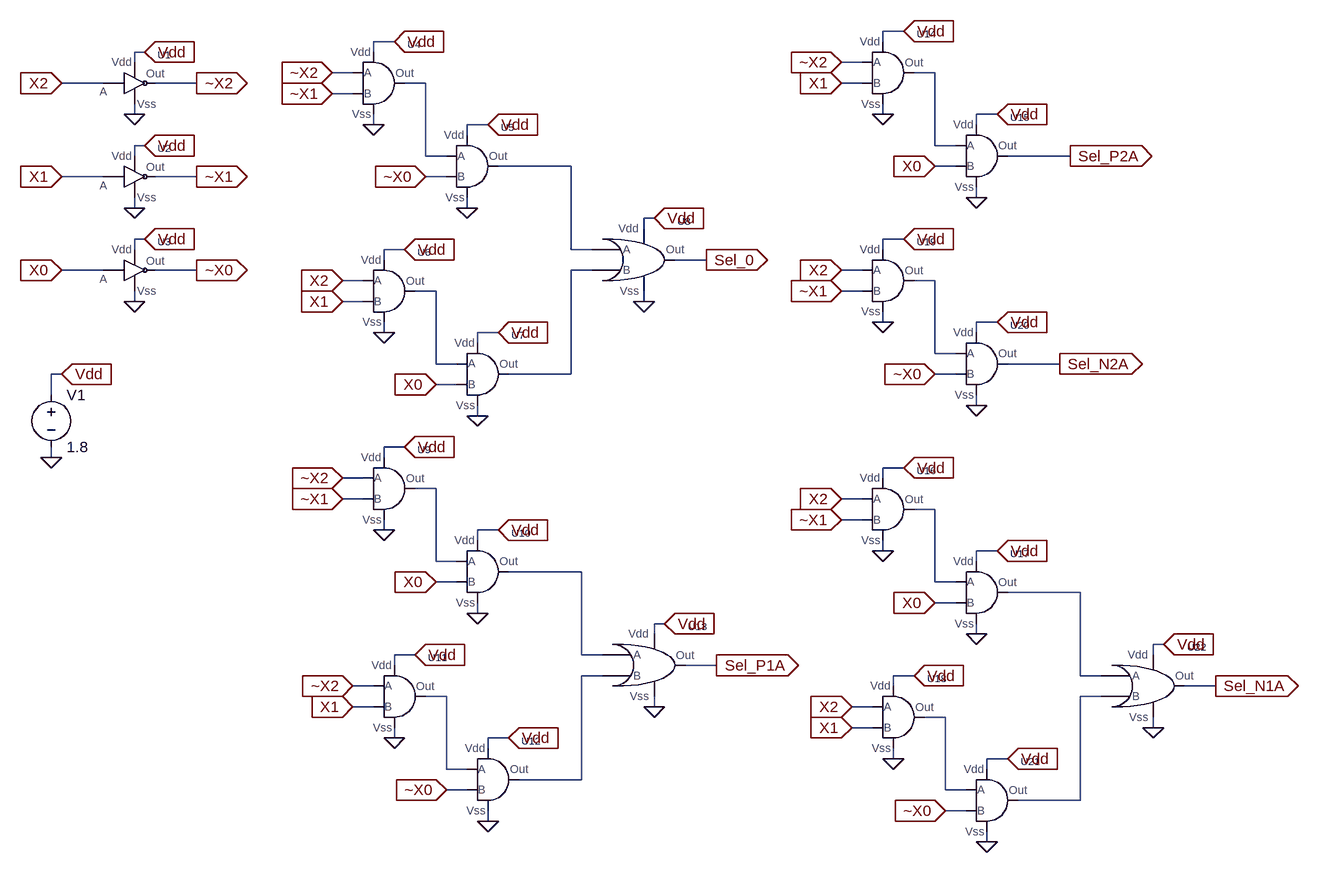
[diagram p0: schematic Encoder.asc]
Encoder.asc, the LTspice schematic file:
Version 4
SHEET 1 2204 1432
WIRE 1360 160 1328 160
WIRE 576 176 544 176
WIRE 1328 176 1328 160
WIRE 192 192 176 192
WIRE 544 192 544 176
WIRE 176 208 176 192
WIRE 1296 208 1264 208
WIRE 512 224 480 224
WIRE 1408 224 1376 224
WIRE 128 240 64 240
WIRE 272 240 208 240
WIRE 624 240 592 240
WIRE 1296 240 1264 240
WIRE 512 256 480 256
WIRE 176 288 176 272
WIRE 1328 288 1328 272
WIRE 1504 288 1472 288
WIRE 544 304 544 288
WIRE 720 304 688 304
WIRE 1472 304 1472 288
WIRE 688 320 688 304
WIRE 192 336 176 336
WIRE 1408 336 1408 224
WIRE 1440 336 1408 336
WIRE 176 352 176 336
WIRE 624 352 624 240
WIRE 656 352 624 352
WIRE 1616 352 1520 352
WIRE 848 368 736 368
WIRE 1440 368 1408 368
WIRE 128 384 64 384
WIRE 272 384 208 384
WIRE 656 384 624 384
WIRE 1472 416 1472 400
WIRE 176 432 176 416
WIRE 688 432 688 416
WIRE 976 448 960 448
WIRE 960 464 960 448
WIRE 192 480 176 480
WIRE 1360 480 1328 480
WIRE 176 496 176 480
WIRE 592 496 560 496
WIRE 848 496 848 368
WIRE 880 496 848 496
WIRE 1328 496 1328 480
WIRE 560 512 560 496
WIRE 1056 512 1008 512
WIRE 128 528 64 528
WIRE 272 528 208 528
WIRE 880 528 848 528
WIRE 1296 528 1264 528
WIRE 528 544 496 544
WIRE 1408 544 1376 544
WIRE 640 560 608 560
WIRE 1296 560 1264 560
WIRE 176 576 176 560
WIRE 528 576 496 576
WIRE 960 576 960 560
WIRE 1328 608 1328 592
WIRE 1504 608 1472 608
WIRE 560 624 560 608
WIRE 736 624 704 624
WIRE 1472 624 1472 608
WIRE 704 640 704 624
WIRE 1408 656 1408 544
WIRE 1440 656 1408 656
WIRE 640 672 640 560
WIRE 672 672 640 672
WIRE 1600 672 1520 672
WIRE 64 688 48 688
WIRE 848 688 848 528
WIRE 848 688 752 688
WIRE 1440 688 1408 688
WIRE 672 704 640 704
WIRE 48 720 48 688
WIRE 1472 736 1472 720
WIRE 704 752 704 736
WIRE 592 800 560 800
WIRE 48 816 48 800
WIRE 560 816 560 800
WIRE 1360 832 1328 832
WIRE 528 848 496 848
WIRE 1328 848 1328 832
WIRE 640 864 608 864
WIRE 528 880 496 880
WIRE 1296 880 1264 880
WIRE 1408 896 1376 896
WIRE 1296 912 1264 912
WIRE 560 928 560 912
WIRE 736 928 704 928
WIRE 704 944 704 928
WIRE 1328 960 1328 944
WIRE 1504 960 1472 960
WIRE 640 976 640 864
WIRE 672 976 640 976
WIRE 1472 976 1472 960
WIRE 864 992 752 992
WIRE 672 1008 640 1008
WIRE 1408 1008 1408 896
WIRE 1440 1008 1408 1008
WIRE 1632 1024 1520 1024
WIRE 1440 1040 1408 1040
WIRE 704 1056 704 1040
WIRE 992 1072 976 1072
WIRE 976 1088 976 1072
WIRE 1472 1088 1472 1072
WIRE 1760 1104 1744 1104
WIRE 608 1120 576 1120
WIRE 864 1120 864 992
WIRE 896 1120 864 1120
WIRE 1744 1120 1744 1104
WIRE 576 1136 576 1120
WIRE 1072 1136 1024 1136
WIRE 896 1152 864 1152
WIRE 1376 1152 1344 1152
WIRE 1632 1152 1632 1024
WIRE 1664 1152 1632 1152
WIRE 544 1168 512 1168
WIRE 1344 1168 1344 1152
WIRE 1840 1168 1792 1168
WIRE 656 1184 624 1184
WIRE 1664 1184 1632 1184
WIRE 544 1200 512 1200
WIRE 976 1200 976 1184
WIRE 1312 1200 1280 1200
WIRE 1424 1216 1392 1216
WIRE 1312 1232 1280 1232
WIRE 1744 1232 1744 1216
WIRE 576 1248 576 1232
WIRE 752 1248 720 1248
WIRE 720 1264 720 1248
WIRE 1344 1280 1344 1264
WIRE 1520 1280 1488 1280
WIRE 656 1296 656 1184
WIRE 688 1296 656 1296
WIRE 1488 1296 1488 1280
WIRE 864 1312 864 1152
WIRE 864 1312 768 1312
WIRE 688 1328 656 1328
WIRE 1424 1328 1424 1216
WIRE 1456 1328 1424 1328
WIRE 1632 1344 1632 1184
WIRE 1632 1344 1536 1344
WIRE 1456 1360 1424 1360
WIRE 720 1376 720 1360
WIRE 1488 1408 1488 1392
FLAG 176 576 0
FLAG 176 432 0
FLAG 176 288 0
FLAG 192 192 Vdd
IOPIN 192 192 In
FLAG 192 336 Vdd
IOPIN 192 336 In
FLAG 192 480 Vdd
IOPIN 192 480 In
FLAG 64 240 X2
IOPIN 64 240 In
FLAG 64 384 X1
IOPIN 64 384 In
FLAG 64 528 X0
IOPIN 64 528 In
FLAG 272 240 ~X2
IOPIN 272 240 Out
FLAG 272 384 ~X1
IOPIN 272 384 Out
FLAG 272 528 ~X0
IOPIN 272 528 Out
FLAG 48 816 0
FLAG 64 688 Vdd
IOPIN 64 688 In
FLAG 480 224 ~X2
IOPIN 480 224 In
FLAG 480 256 ~X1
IOPIN 480 256 In
FLAG 624 384 ~X0
IOPIN 624 384 In
FLAG 576 176 Vdd
IOPIN 576 176 In
FLAG 720 304 Vdd
IOPIN 720 304 In
FLAG 544 304 0
FLAG 688 432 0
FLAG 496 544 X2
IOPIN 496 544 In
FLAG 496 576 X1
IOPIN 496 576 In
FLAG 640 704 X0
IOPIN 640 704 In
FLAG 592 496 Vdd
IOPIN 592 496 In
FLAG 736 624 Vdd
IOPIN 736 624 In
FLAG 560 624 0
FLAG 704 752 0
FLAG 976 448 Vdd
IOPIN 976 448 In
FLAG 960 576 0
FLAG 1056 512 Sel_0
IOPIN 1056 512 Out
FLAG 496 848 ~X2
IOPIN 496 848 In
FLAG 496 880 ~X1
IOPIN 496 880 In
FLAG 640 1008 X0
IOPIN 640 1008 In
FLAG 592 800 Vdd
IOPIN 592 800 In
FLAG 736 928 Vdd
IOPIN 736 928 In
FLAG 560 928 0
FLAG 704 1056 0
FLAG 512 1168 ~X2
IOPIN 512 1168 In
FLAG 512 1200 X1
IOPIN 512 1200 In
FLAG 656 1328 ~X0
IOPIN 656 1328 In
FLAG 608 1120 Vdd
IOPIN 608 1120 In
FLAG 752 1248 Vdd
IOPIN 752 1248 In
FLAG 576 1248 0
FLAG 720 1376 0
FLAG 992 1072 Vdd
IOPIN 992 1072 In
FLAG 976 1200 0
FLAG 1072 1136 Sel_P1A
IOPIN 1072 1136 Out
FLAG 1264 208 ~X2
IOPIN 1264 208 In
FLAG 1264 240 X1
IOPIN 1264 240 In
FLAG 1408 368 X0
IOPIN 1408 368 In
FLAG 1360 160 Vdd
IOPIN 1360 160 In
FLAG 1504 288 Vdd
IOPIN 1504 288 In
FLAG 1328 288 0
FLAG 1472 416 0
FLAG 1616 352 Sel_P2A
IOPIN 1616 352 Out
FLAG 1264 528 X2
IOPIN 1264 528 In
FLAG 1264 560 ~X1
IOPIN 1264 560 In
FLAG 1408 688 ~X0
IOPIN 1408 688 In
FLAG 1360 480 Vdd
IOPIN 1360 480 In
FLAG 1504 608 Vdd
IOPIN 1504 608 In
FLAG 1328 608 0
FLAG 1472 736 0
FLAG 1600 672 Sel_N2A
IOPIN 1600 672 Out
FLAG 1264 880 X2
IOPIN 1264 880 In
FLAG 1264 912 ~X1
IOPIN 1264 912 In
FLAG 1408 1040 X0
IOPIN 1408 1040 In
FLAG 1360 832 Vdd
IOPIN 1360 832 In
FLAG 1504 960 Vdd
IOPIN 1504 960 In
FLAG 1328 960 0
FLAG 1472 1088 0
FLAG 1280 1200 X2
IOPIN 1280 1200 In
FLAG 1280 1232 X1
IOPIN 1280 1232 In
FLAG 1424 1360 ~X0
IOPIN 1424 1360 In
FLAG 1376 1152 Vdd
IOPIN 1376 1152 In
FLAG 1520 1280 Vdd
IOPIN 1520 1280 In
FLAG 1344 1280 0
FLAG 1488 1408 0
FLAG 1760 1104 Vdd
IOPIN 1760 1104 In
FLAG 1744 1232 0
FLAG 1840 1168 Sel_N1A
IOPIN 1840 1168 Out
SYMBOL NOT1 160 240 R0
SYMATTR InstName U1
SYMBOL NOT1 160 384 R0
SYMATTR InstName U2
SYMBOL NOT1 160 528 R0
SYMATTR InstName U3
SYMBOL voltage 48 704 R0
WINDOW 123 0 0 Left 0
WINDOW 39 0 0 Left 0
SYMATTR InstName V1
SYMATTR Value 1.8
SYMBOL AND1 528 240 R0
SYMATTR InstName U4
SYMBOL AND1 672 368 R0
SYMATTR InstName U5
SYMBOL AND1 544 560 R0
SYMATTR InstName U6
SYMBOL AND1 688 688 R0
SYMATTR InstName U7
SYMBOL OR1 896 512 R0
SYMATTR InstName U8
SYMBOL AND1 544 864 R0
SYMATTR InstName U9
SYMBOL AND1 688 992 R0
SYMATTR InstName U10
SYMBOL AND1 560 1184 R0
SYMATTR InstName U11
SYMBOL AND1 704 1312 R0
SYMATTR InstName U12
SYMBOL OR1 912 1136 R0
SYMATTR InstName U13
SYMBOL AND1 1312 224 R0
SYMATTR InstName U14
SYMBOL AND1 1456 352 R0
SYMATTR InstName U15
SYMBOL AND1 1312 544 R0
SYMATTR InstName U19
SYMBOL AND1 1456 672 R0
SYMATTR InstName U20
SYMBOL AND1 1312 896 R0
SYMATTR InstName U16
SYMBOL AND1 1456 1024 R0
SYMATTR InstName U17
SYMBOL AND1 1328 1216 R0
SYMATTR InstName U18
SYMBOL AND1 1472 1344 R0
SYMATTR InstName U21
SYMBOL OR1 1680 1168 R0
SYMATTR InstName U22

The netlist it stands for:
* Encoder.asc
XU1 Vdd 0 X2 ~X2 NOT1  ; pins Vdd Vss A Out
XU2 Vdd 0 X1 ~X1 NOT1  ; pins Vdd Vss A Out
XU3 Vdd 0 X0 ~X0 NOT1  ; pins Vdd Vss A Out
V1 Vdd 0 1.8
XU4 Vdd 0 ~X2 ~X1 N002 AND1  ; pins Vdd Vss A B Out
XU5 Vdd 0 N002 ~X0 N003 AND1  ; pins Vdd Vss A B Out
XU6 Vdd 0 X2 X1 N006 AND1  ; pins Vdd Vss A B Out
XU7 Vdd 0 N006 X0 N004 AND1  ; pins Vdd Vss A B Out
XU8 Vdd 0 Sel_0 N003 N004 OR1  ; pins Vdd Vss Out A B
XU9 Vdd 0 ~X2 ~X1 N007 AND1  ; pins Vdd Vss A B Out
XU10 Vdd 0 N007 X0 N009 AND1  ; pins Vdd Vss A B Out
XU11 Vdd 0 ~X2 X1 N012 AND1  ; pins Vdd Vss A B Out
XU12 Vdd 0 N012 ~X0 N011 AND1  ; pins Vdd Vss A B Out
XU13 Vdd 0 Sel_P1A N009 N011 OR1  ; pins Vdd Vss Out A B
XU14 Vdd 0 ~X2 X1 N001 AND1  ; pins Vdd Vss A B Out
XU15 Vdd 0 N001 X0 Sel_P2A AND1  ; pins Vdd Vss A B Out
XU19 Vdd 0 X2 ~X1 N005 AND1  ; pins Vdd Vss A B Out
XU20 Vdd 0 N005 ~X0 Sel_N2A AND1  ; pins Vdd Vss A B Out
XU16 Vdd 0 X2 ~X1 N008 AND1  ; pins Vdd Vss A B Out
XU17 Vdd 0 N008 X0 N010 AND1  ; pins Vdd Vss A B Out
XU18 Vdd 0 X2 X1 N014 AND1  ; pins Vdd Vss A B Out
XU21 Vdd 0 N014 ~X0 N013 AND1  ; pins Vdd Vss A B Out
XU22 Vdd 0 Sel_N1A N010 N013 OR1  ; pins Vdd Vss Out A B
.lib NOT1.sub
.lib AND1.sub
.lib OR1.sub
.backanno
.end